# Altium schematic sheet Sheet3.SchDoc
size A4
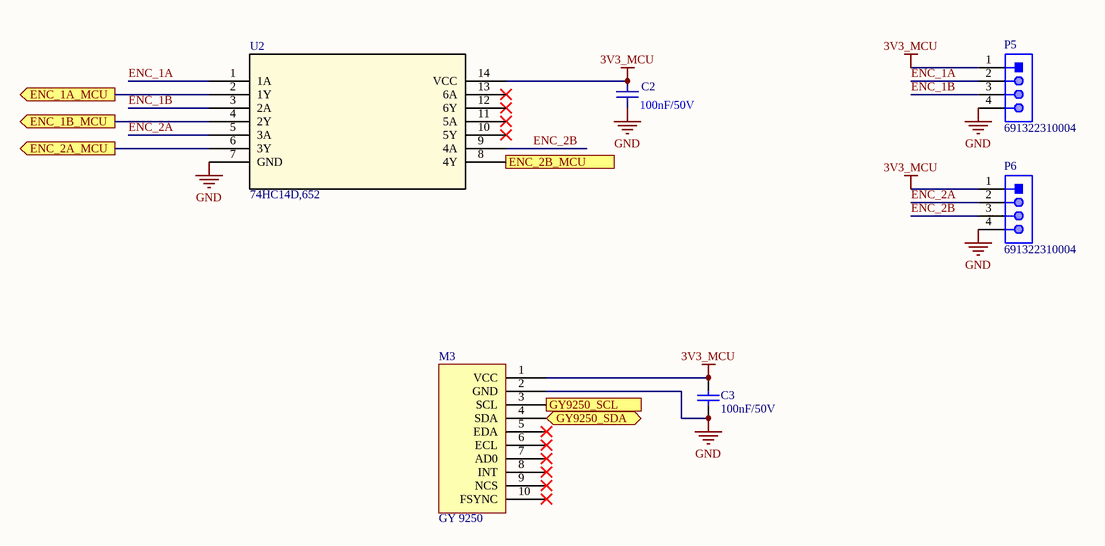
[diagram p0: Sheet3.SchDoc]

## Parts
C2  value 100nF/50V  [CAP-SM-0805]  (hidden comment: Cap Non-Pol SMD)
C3  value 100nF/50V  [CAP-SM-0805]  (hidden comment: Cap-1nF-50V-0805)
M3  GY 9250  [GY 9250]
P5  691322310004  [691322310004]
P6  691322310004  [691322310004]
U2  74HC14D,652  [74HC14D,652]

## Ports
ENC_1A_MCU (out), ENC_1B_MCU (out), ENC_2A_MCU (out), ENC_2B_MCU (out), GY9250_SCL (in), GY9250_SDA (bidir)

## Nets
3V3_MCU: C2.2 C3.2 M3.1(VCC) P5.1 P6.1 U2.14(VCC)
GND: C2.1 C3.1 M3.2(GND) P5.4 P6.4 U2.7(GND)
ENC_1A: P5.2 U2.1(1A)
ENC_1A_MCU: U2.2(1Y) ; port ENC_1A_MCU
ENC_1B: P5.3 U2.3(2A)
ENC_1B_MCU: U2.4(2Y) ; port ENC_1B_MCU
ENC_2A: P6.2 U2.5(3A)
ENC_2A_MCU: U2.6(3Y) ; port ENC_2A_MCU
ENC_2B: P6.3 U2.9(4A)
ENC_2B_MCU: U2.8(4Y) ; port ENC_2B_MCU
GY9250_SCL: M3.3(SCL) ; port GY9250_SCL
GY9250_SDA: M3.4(SDA) ; port GY9250_SDA

Not connected (* = marked no-connect by the designer): M3 5(EDA)* 6(ECL)* 7(AD0)* 8(INT)* 9(NCS)* 10(FSYNC)*; U2 10(5Y)* 11(5A)* 12(6Y)* 13(6A)*

## Library data of the parts
C2 = Cap Non-Pol SMD: Capacitor
C3 = Cap-1nF-50V-0805: CAP CER 1000PF 100V X7R 0805; Manufacturer: Johanson Dielectrics Inc.; Manufacturer Part Number: 101X15W102MV4E; Local Supplier: thegioiic; Local Supplier Link: https://thegioiic.com/products/tu-1nf-50v-0805; Supplier 1: Digikey; Supplier 1 Link: https://www.digikey.com/product-detail/en/johanson-dielectrics-inc/101X15W102MV4E/709-1335-1-ND/2327235; Supplier 1 Part Number: 709-1335-1-ND
P5 P6 = 691322310004: WR-TBL Serie 322 Horizontal PCB Header, Pluggable, pitch 3.81mm, 4p; Compliance: RoHS; Modularity: No; Pin Number: 4; Rated Current [UL]: 10A; Working Voltage [UL]: 300VAC; ComponentLink1Description: Manufacturer; ComponentLink1URL: http://www.we-online.de; ComponentLink2URL: https://katalog.we-online.de/em/datasheet/691322310004.pdf; ComponentLink2Description: Datasheet; Mounting Technology: THT; Part Number: 691322310004; Packaging: Box; Operating Temperature: -40 to +105degC; PCB/Cable/Panel: PCB; Pitch: 3.81mm; Published Date: October 2019; Type: Horizontal; Publisher: Wurth Elektronik; Application: Pluggable
U2 = 74HC14D,652: Vendor: Nexperia; SourceLibrary: Nexperia_2018-05-2018; Manufacturer_Part_Number: 74HC14D,652; Copyright: Copyright (C) 2016 Accelerated Designs. All rights reserved; RefDes: RefDes; Type: DEV